# EAGLE design 12V_Analog_Controller (EAGLE 9.6.2)
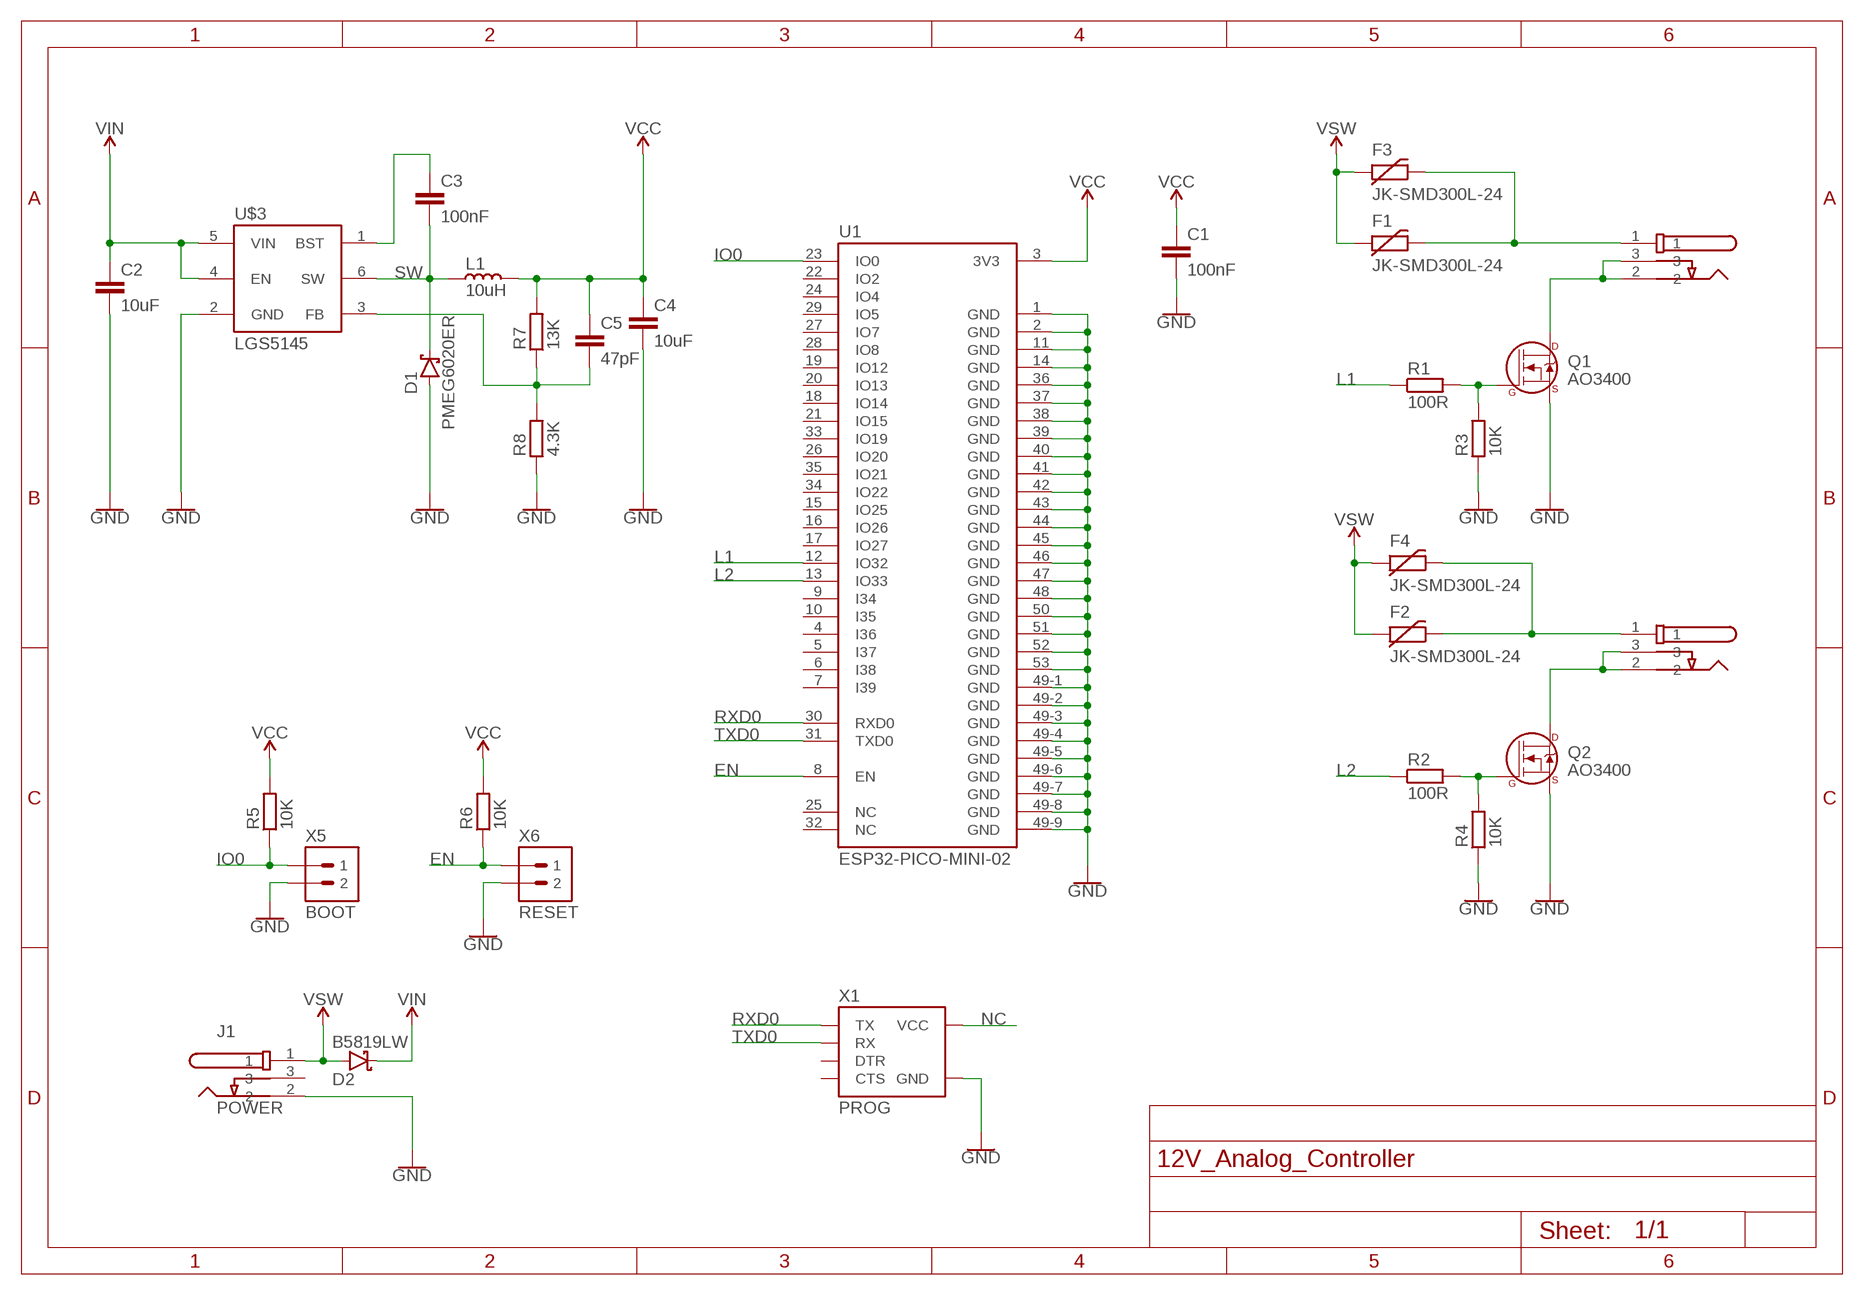
[diagram p0: schematic, sheet 1]

## Parts
C1  100nF  CAPC0603  [C0603]
C2  10uF  CAPC0603  [C0603]
C3  100nF  CAPC0603  [C0603]
C4  10uF  CAPC0603  [C0603]
C5  47pF  CAPC0603  [C0603]
D1  PMEG6020ER  DIODE-SCHOTTKYSOD123FL  [SOD-123FL]
D2  B5819LW  DIODE-SCHOTTKYSOD-123  [SOD-123]
F1  JK-SMD300L-24  PTCJK-SMD300  [JK-SMD300]
F2  JK-SMD300L-24  PTCJK-SMD300  [JK-SMD300]
F3  JK-SMD300L-24  PTCJK-SMD300  [JK-SMD300]
F4  JK-SMD300L-24  PTCJK-SMD300  [JK-SMD300]
J1  POWER  XKB-DC-005-5A-2.0  [XKB-DC-005-5A-2.0]
L1  10uH  IND-YJYCOIN-YNR4062  [YJYCOIN-YNR4062]
Q1  AO3400  MOSFET-NCHSOT23-3  [SOT23-3]
Q2  AO3400  MOSFET-NCHSOT23-3  [SOT23-3]
R1  100R  RESISTOR0603  [R0603]
R2  100R  RESISTOR0603  [R0603]
R3  10K  RESISTOR0603  [R0603]
R4  10K  RESISTOR0603  [R0603]
R5  10K  RESISTOR0603  [R0603]
R6  10K  RESISTOR0603  [R0603]
R7  13K  RESISTOR0603  [R0603]
R8  4.3K  RESISTOR0603  [R0603]
U1  ESP32-PICO-MINI-02  [ESP32-PICO-MINI-02]
U$3  LGS5145  LEGEND-SI-LGS5145  [SOT23-6]
X1  PROG  HEADER-FTDI232  [FTDI232-1X06]
X2  L1  XKB-DC-005-5A-2.0  [XKB-DC-005-5A-2.0]
X3  L2  XKB-DC-005-5A-2.0  [XKB-DC-005-5A-2.0]
X5  BOOT  HEADER-1X02-2.54  [1X02-2.54]
X6  RESET  HEADER-1X02-2.54  [1X02-2.54]

## Nets
EN: R6.1 U1.8(EN) X6.1
GND: C1.2 C2.2 C4.2 D1.A J1.2 Q1.2(S) Q2.2(S) R3.1 R4.1 R8.1 U1.1(GND) U1.2(GND) U1.11(GND) U1.14(GND) U1.36(GND) U1.37(GND) U1.38(GND) U1.39(GND) U1.40(GND) U1.41(GND) U1.42(GND) U1.43(GND) U1.44(GND) U1.45(GND) U1.46(GND) U1.47(GND) U1.48(GND) U1.49-1(GND) U1.49-2(GND) U1.49-3(GND) U1.49-4(GND) U1.49-5(GND) U1.49-6(GND) U1.49-7(GND) U1.49-8(GND) U1.49-9(GND) U1.50(GND) U1.51(GND) U1.52(GND) U1.53(GND) U$3.2(GND) X1.GND X5.2 X6.2
IO0: R5.1 U1.23(IO0) X5.1
L1: R1.1 U1.12(IO32)
L2: R2.1 U1.13(IO33)
N$1: Q1.3(D) X2.2 X2.3
N$2: Q2.3(D) X3.2 X3.3
N$3: Q2.1(G) R2.2 R4.2
N$4: Q1.1(G) R1.2 R3.2
N$5: F1.B F3.B X2.1
N$6: F2.B F4.B X3.1
N$7: C3.1 U$3.1(BST)
N$10: C5.2 R7.1 R8.2 U$3.3(FB)
NC: X1.VCC
RXD0: U1.30(RXD0) X1.TX
SW: C3.2 D1.C L1.1 U$3.6(SW)
TXD0: U1.31(TXD0) X1.RX
VCC: C1.1 C4.1 C5.1 L1.2 R5.2 R6.2 R7.2 U1.3(3V3)
VIN: C2.1 D2.C U$3.4(EN) U$3.5(VIN)
VSW: D2.A F1.A F2.A F3.A F4.A J1.1
Unconnected: J1.3 U1.4(I36) U1.5(I37) U1.6(I38) U1.7(I39) U1.9(I34) U1.10(I35) U1.15(IO25) U1.16(IO26) U1.17(IO27) U1.18(IO14) U1.19(IO12) U1.20(IO13) U1.21(IO15) U1.22(IO2) U1.24(IO4) U1.25(NC) U1.26(IO20) U1.27(IO7) U1.28(IO8) U1.29(IO5) U1.32(NC) U1.33(IO19) U1.34(IO22) U1.35(IO21) X1.CTS X1.DTR

## Library data of the parts
C1-C5 = M2M-Passives:CAP
D1 D2 = M2M-DiscreteSemi:DIODE-SCHOTTKY: 304020028
F1-F4 = M2M-Fuse:PTC
J1 X2 X3 = M2M-Connectors:XKB-DC-005-5A-2.0
L1 = M2M-Passives:IND-YJYCOIN
Q1 Q2 = M2M-DiscreteSemi:MOSFET-NCH
R1-R8 = M2M-Passives:RESISTOR
U1 = M2M-Modules:ESP32-PICO-MINI-02
U$3 = M2M-IC:LEGEND-SI-LGS5145
X1 = M2M-Connectors:HEADER-FTDI232
X5 X6 = M2M-Connectors:HEADER-1X02-2.54

## Board
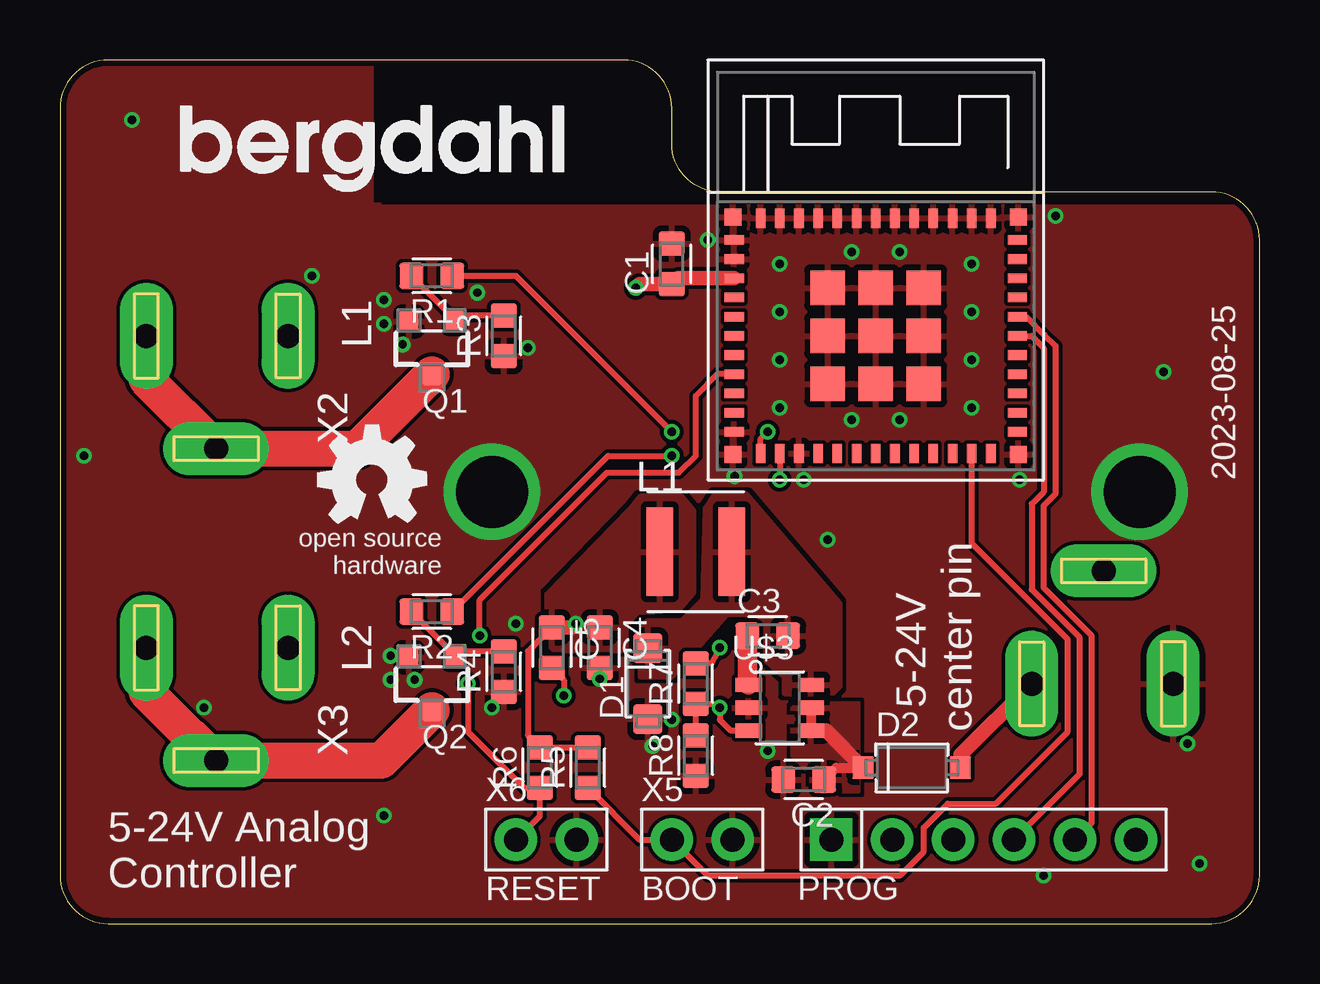
[diagram p1: board, top side]
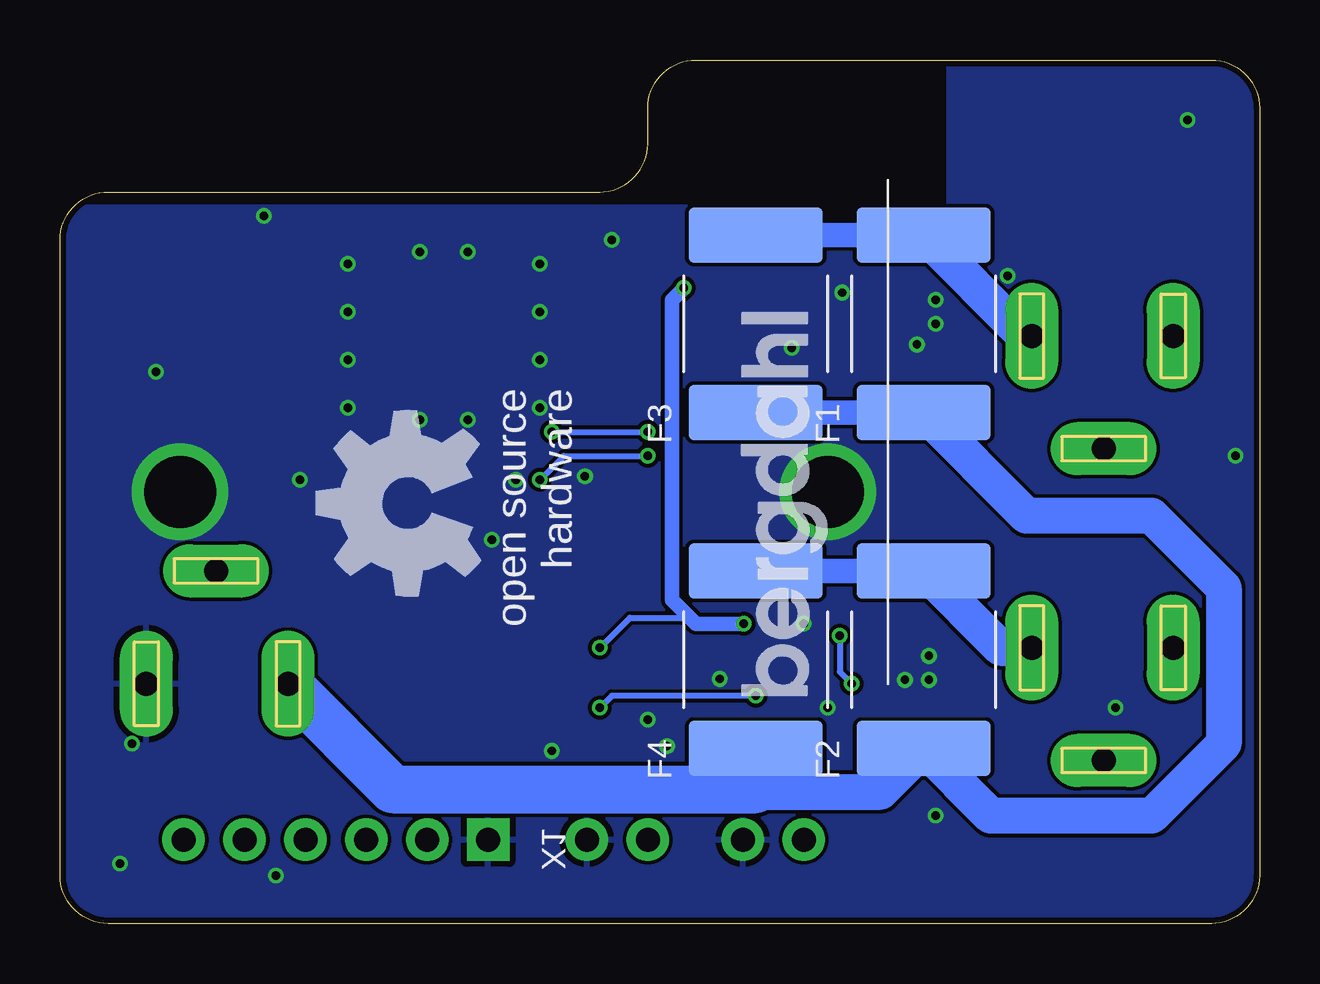
[diagram p2: board, bottom side, seen from below]

Size 50 x 36 mm. Coordinates in mm from the lower left corner, seen from the top.
Outline: 0,34 0,2 arc90 2,0 48,0 arc90 50,2 50,28.5 arc90 48,30.5 27.5,30.5 arc-90 25.5,32.5 25.5,34 arc90 23.5,36 2,36 arc90 0,34
Copper layers (1*16): Top 0.035mm / dielectric 1.5mm / Bottom 0.035mm
Design rules "SeeedStudio_2layer_DRU_no_angle_20140221": minimum track width 6mil, minimum drill 0.3mm, track to track 6mil, track to pad 6mil, pad to pad 6mil, via to via 6mil, smd to smd 0mil, copper to edge 10mil, drill to drill 10mil, minimum pad ring 2mil, minimum via ring 6mil, stop-mask expansion 2mil, vias tented up to drill 1000mil, thermal gap 10mil

### Footprints (pad centres in the part's own frame; a part is rotated, then mirrored left to right if it is on the bottom)
C0603 = smd 1 x 1.1: 1 -0.85,0; 2 0.85,0
SOD-123FL = smd 1.25 x 1.22: A -1.475,0; C 1.475,0
SOD-123 = smd 0.9 x 0.95: A 2.025,0; C -2.025,0
JK-SMD300 = smd 2.3 x 5.6: A -3.7,0; B 3.7,0
XKB-DC-005-5A-2.0 = drill 1 pad 2.2 long: 1 3,0; 2 -2.9,0; 3 0,-4.7
YJYCOIN-YNR4062 = smd 3.7 x 1.1: 1 0,1.5; 2 0,-1.5
SOT23-3 = smd 0.8 x 0.9: 1 -0.95,-1.1; 2 0.95,-1.1; 3 0,1.1
R0603 = smd 1 x 1.1: 1 -0.85,0; 2 0.85,0
ESP32-PICO-MINI-02 = smd 0.8 x 0.4: 1 -5.9,4; 2 -5.9,3.2; 3 -5.9,2.4; 4 -5.9,1.6; 5 -5.9,0.8; 6 -5.9,0; 7 -5.9,-0.8; 8 -5.9,-1.6; 9 -5.9,-2.4; 10 -5.9,-3.2; 11 -5.9,-4; 25 5.9,-4; 26 5.9,-3.2; 27 5.9,-2.4; 28 5.9,-1.6; 29 5.9,-0.8; 30 5.9,0; 31 5.9,0.8; 32 5.9,1.6; 33 5.9,2.4; 34 5.9,3.2; 35 5.9,4 | smd 0.4 x 0.8: 12 -4.8,-4.9; 13 -4,-4.9; 14 -3.2,-4.9; 15 -2.4,-4.9; 16 -1.6,-4.9; 17 -0.8,-4.9; 18 0,-4.9; 19 0.8,-4.9; 20 1.6,-4.9; 21 2.4,-4.9; 22 3.2,-4.9; 23 4,-4.9; 24 4.8,-4.9; 36 4.8,4.9; 37 4,4.9; 38 3.2,4.9; 39 2.4,4.9; 40 1.6,4.9; 41 0.8,4.9; 42 0,4.9; 43 -0.8,4.9; 44 -1.6,4.9; 45 -2.4,4.9; 46 -3.2,4.9; 47 -4,4.9; 48 -4.8,4.9 | smd 1.45 x 1.45: 49-1 -2,2; 49-2 0,2; 49-3 2,2; 49-4 -2,0; 49-5 0,0; 49-6 2,0; 49-7 -2,-2; 49-8 0,-2; 49-9 2,-2 | smd 0.7 x 0.7: 50 5.95,4.95; 51 5.95,-4.95; 52 -5.95,-4.95; 53 -5.95,4.95
SOT23-6 = smd 1.1 x 0.6: 1 -1.3,0.95; 2 -1.3,0; 3 -1.3,-0.95; 4 1.3,-0.95; 5 1.3,0; 6 1.3,0.95
FTDI232-1X06 = drill 1 pad 1.778: CTS 0,3.81; DTR 0,-6.35; RX 0,-3.81; TX 0,-1.27; VCC 0,1.27 | drill 1 pad 1.778 square: GND 0,6.35
1X02-2.54 = drill 1 pad 1.778: 1 0,0; 2 2.54,0

### Placement (x,y rotation side)
C1  25.5,27.5 90 top
C2  31,6 180 top
C3  29.5,12 0 top
C4  22.5,11.5 270 top
C5  20.5,11.5 270 top
D1  24.5,10 90 top
D2  35.5,6.5 0 top
F1  14,25 90 bottom
F2  14,11 90 bottom
F3  21,25 90 bottom
F4  21,11 90 bottom
J1  43.5,10 180 top
L1  26.5,15.5 270 top
Q1  15.5,24 180 top
Q2  15.5,10 180 top
R1  15.5,27 180 top
R2  15.5,13 180 top
R3  18.5,24.5 90 top
R4  18.5,10.5 90 top
R5  22,6.5 90 top
R6  20,6.5 90 top
R7  26.5,10 90 top
R8  26.5,7 90 top
U1  34,24.5 0 top
U$1  [BERGDAHL-20MM-BPLACE]  18,25.5 270 top
U$2  [OSHW-8MM-BPLACE]  35.5,17.5 270 top
U$3  30,9 0 top
U$4  [OSHW-5MM-TPLACE]  13,18.5 0 top
U$5  [BERGDAHL-20MM-TPLACE]  5,30.5 0 top
X1  38.5,3.5 90 top
X2  6.5,24.5 0 top
X3  6.5,11.5 0 top
X5  25.5,3.5 0 top
X6  19,3.5 0 top

### Tracks (layer width: path | path; a pad name or v marks a point on that pad's centre or on a via)
EN  (via drill 0.35)
  Top 0.254: U1.8 27.4,22.9 26.5,22 26.5,19.5 25.8,18.8 22.8,18.8 17.5,13.5 v17.5,12 | X6.1 20,4.5 R6.1 19.35,5.65 17,8 v17,10
  Bottom 0.254: v17.5,12 17.5,10.5 v17,10
GND  (via drill 0.35, 3)
  other vias: 18,18 45,18 30,27.5 30,25.5 30,23.5 30,21.5 33,21 35,21 38,21.5 38,23.5 38,25.5 38,27.5 35,28 33,28 41.5,29.5 17.4,26.3 27,28.5 40,18.5 31,18.5 28.12,18.64 47.5,2.5 46,23 47,7.5 41,2 22.5,10.2 24.7,7.4 6,9 1,19.5 3,33.5 13.5,25 13.5,26 14.28,24.14 14.78,10.16 13.78,11.16 13.78,10.16 13.5,4.5 10.5,27 32,16 25.5,8.5 29.5,7.2 18,9 19.5,24 19,12.5
  pour Top (rank 5): 0,36 13,36 13,30 50,30 50,0 0,0
  pour Bottom: 0,36 13,36 13,30 50,30 50,0 0,0
IO0
  Top 0.254: R5.1 24.15,3.5 X5.1 27,2 35,2 36,3 36,4 37,5 39,5 42,8 42,11.85 38,15.85 38,16 U1.23
L1  (via drill 0.35)
  Top 0.254: R1.1 19,27 v25.5,20.5 | U1.12 29.2,20.2 v29.5,20.5
  Bottom 0.254: v29.5,20.5 v25.5,20.5
L2  (via drill 0.35)
  Top 0.254: U1.13 v30,18.5 | R2.1 22.85,19.5 v25.5,19.5
  Bottom 0.254: v30,18.5 29,19.5 v25.5,19.5
N$1
  Top 1.5: X2.2 3.6,22.7 X2.3 12.4,19.8 Q1.3
N$2
  Top 1.5: X3.2 3.6,9.66 5.49,7.77 5.53,7.77 X3.3 13.4,6.8 Q2.3
N$3
  Top 0.254: R2.2 16.45,11.2 Q2.1 16.7,11.35 R4.2
N$4
  Top 0.254: R1.2 16.45,25.2 Q1.1 16.7,25.35 R3.2
N$5
  Bottom 1.016: F1.B F3.B
  Bottom 1.5: F1.B 9.8,24.5 X2.1
N$6
  Bottom 1.016: F2.B F4.B
  Bottom 1.5: F2.B 10.8,11.5 X3.1
N$7
  Top 0.813: C3.1 28.65,10 U$3.1
N$10  (via drill 0.35)
  Top 0.254: C5.2 21,10.15 v21,9.5 | R8.2 26.5,9 26.57,9.07 R7.1 27.35,9.15 v27.5,9 27.5,8.5 27.95,8.05 U$3.3
  Bottom 0.254: v21,9.5 27,9.5 v27.5,9
RXD0
  Top 0.254: U1.30 40.5,24.5 41,24 41,18 40.5,17.5 40.5,13.93 42.5,11.93 42.5,6.23 X1.TX
SW
  pour Top: 30.2,9.6 32.2,9.6 32.5,9.9 32.5,13.33 28.6,17.9 27.3,17.9 26.9,17.3 26.8,13.5 25.9,12.6 24.5,12.6 24.2,12.4 24.2,10.3 25.5,10.3 27.8,12.9 29,12.9 29.4,12.6 29.44,10.96 30.2,10.3
TXD0
  Top 0.254: U1.31 40.27,25.3 41.04,24.54 41.5,24.07 41.5,17.93 41,17.43 41,14 43,12 43,4.19 X1.RX
VCC  (via drill 0.35)
  Top 0.254: v27.5,11.5 27.15,10.85 R7.2 | C5.1 19.5,11.35 19.5,7.85 R6.2 R5.2
  Top 0.61: U1.3 25.75,26.9 C1.1 24.15,26.65 v24,26.5 | C5.1 21.35,12.35 v21.5,12.5
  Bottom 0.254: v27.5,11.5 26.25,12.75 23.75,12.75
  Bottom 0.61: v21.5,12.5 23.5,12.5 23.75,12.75 24.5,13.5 24.5,26 v24,26.5
  pour Top: 20.6,11.4 23.4,11.4 23.6,11.6 23.6,12.5 24.1,13 25.8,13.1 26.4,13.8 26.4,17.2 25.9,17.8 24.2,17.8 23.8,17.3 20.3,13.7 20.3,11.7
VIN
  Top 0.406: U$3.5 U$3.4 | C2.1 32.35,6.5 D2.C
  Top 0.61: D2.C 31.93,8.05 U$3.4
  pour Top: 33.3,9.2 30.7,9.2 30.5,9 30.5,7 31.3,6.2 31.3,5.6 31.4,5.5 33.3,5.5
VSW
  Top 0.61: D2.A 37.52,7.03 J1.1
  Bottom 0.61: F4.A 21,5.6 21,5.5
  Bottom 1.016: F1.A F3.A
  Bottom 1.5: 21,5.5 15.8,5.5 F2.A 11.2,4.5 4.5,4.5 1.5,7.5 1.5,14 4.5,17 9.7,17 F1.A | J1.1 40.5,9.96
  Bottom 2: 21,5.6 36.14,5.6 40.5,9.96

### Text on the board
tPlace: L1 | 2023-08-25 | L2 | 5-24V / center pin | 5-24V Analog / Controller
Measures: Mounting holes / 2x3mm